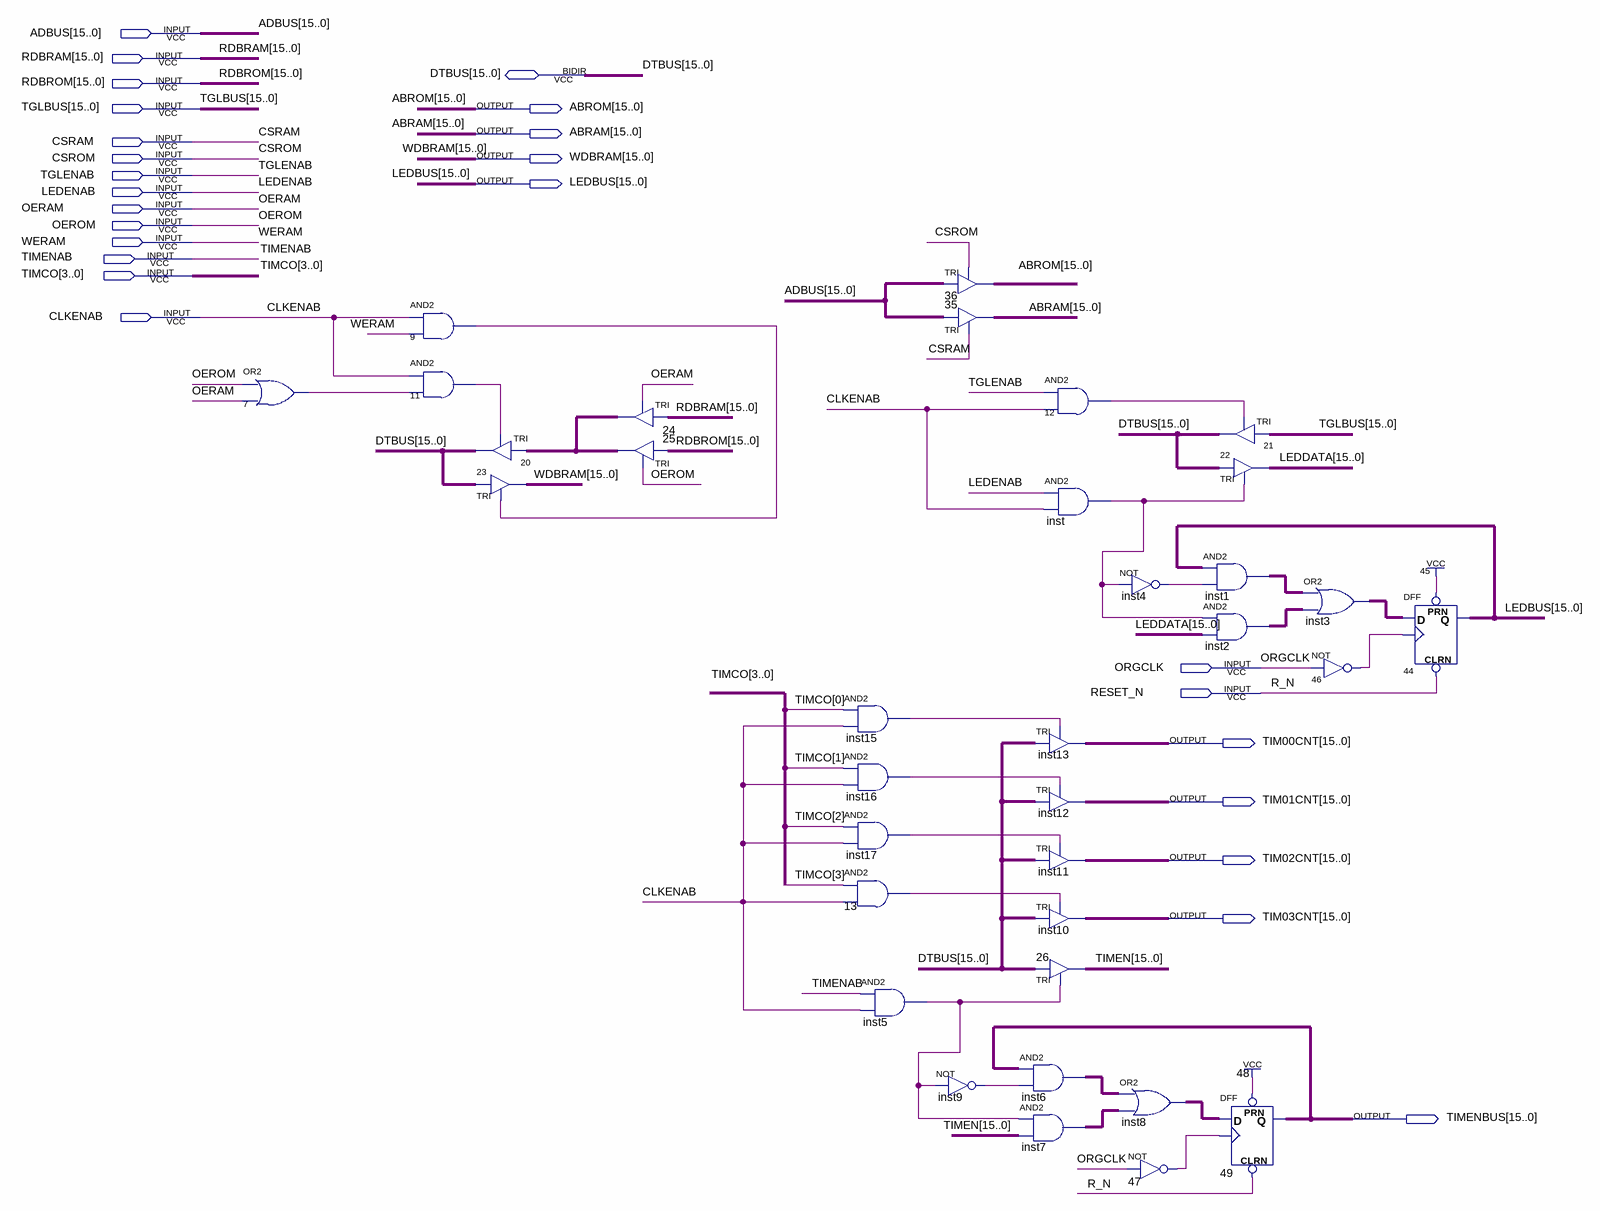
[diagram p0: schematic sheet]
// Quartus schematic sep5_busctrl_timer.bdf as structural Verilog: 35 symbols, 26 pins
module sep5_busctrl_timer (
  input  [15:0] ADBUS,
  input  [15:0] RDBRAM,
  input  [15:0] RDBROM,
  input  [15:0] TGLBUS,
  input  CSRAM,
  input  CSROM,
  input  TGLENAB,
  input  LEDENAB,
  input  OERAM,
  input  OEROM,
  input  WERAM,
  input  TIMENAB,
  input  [3:0] TIMCO,
  input  CLKENAB,
  input  ORGCLK,
  input  RESET_N,
  inout  [15:0] DTBUS,
  output [15:0] ABROM,
  output [15:0] ABRAM,
  output [15:0] WDBRAM,
  output [15:0] LEDBUS,
  output [15:0] TIM00CNT,
  output [15:0] TIM01CNT,
  output [15:0] TIM02CNT,
  output [15:0] TIM03CNT,
  output [15:0] TIMENBUS
);

  wire inst4_out, inst5_out, inst9_out, inst15_out, inst16_out, inst17_out, inst_out, n7_out, n9_out,
       n11_out, n12_out, n13_out, n46_out, n47_out;
  wire [15:0] inst1_out, inst2_out, inst3_out, inst6_out, inst7_out, inst8_out, LEDDATA, n24_out, TIMEN;

  or u_7 (n7_out, OEROM, OERAM);
  and u_9 (n9_out, CLKENAB, WERAM);
  and u_11 (n11_out, CLKENAB, n7_out);
  TRI u_20[15:0] (.IN(n24_out), .OE(n11_out), .OUT(DTBUS));
  TRI u_23[15:0] (.IN(DTBUS), .OE(n9_out), .OUT(WDBRAM));
  TRI u_24[15:0] (.IN(RDBRAM), .OE(OERAM), .OUT(n24_out));
  TRI u_25[15:0] (.IN(RDBROM), .OE(OEROM), .OUT(n24_out));
  and inst15 (inst15_out, TIMCO[0], CLKENAB);
  and inst16 (inst16_out, TIMCO[1], CLKENAB);
  and inst17 (inst17_out, TIMCO[2], CLKENAB);
  and u_13 (n13_out, TIMCO[3], CLKENAB);
  and inst5 (inst5_out, TIMENAB, CLKENAB);
  TRI u_36[15:0] (.IN(ADBUS), .OE(CSROM), .OUT(ABROM));
  TRI u_35[15:0] (.IN(ADBUS), .OE(CSRAM), .OUT(ABRAM));
  not inst9 (inst9_out, inst5_out);
  and u_12 (n12_out, TGLENAB, CLKENAB);
  and inst (inst_out, LEDENAB, CLKENAB);
  TRI inst13[15:0] (.IN(DTBUS), .OE(inst15_out), .OUT(TIM00CNT));
  TRI inst12[15:0] (.IN(DTBUS), .OE(inst16_out), .OUT(TIM01CNT));
  TRI inst11[15:0] (.IN(DTBUS), .OE(inst17_out), .OUT(TIM02CNT));
  TRI inst10[15:0] (.IN(DTBUS), .OE(n13_out), .OUT(TIM03CNT));
  TRI u_26[15:0] (.IN(DTBUS), .OE(inst5_out), .OUT(TIMEN));
  assign inst6_out = TIMENBUS & {16{inst9_out}};  // AND2 inst6, 16 bits wide
  assign inst7_out = {16{inst5_out}} & TIMEN;  // AND2 inst7, 16 bits wide
  not inst4 (inst4_out, inst_out);
  assign inst8_out = inst6_out | inst7_out;  // OR2 inst8, 16 bits wide
  not u_47 (n47_out, ORGCLK);
  TRI u_21[15:0] (.IN(TGLBUS), .OE(n12_out), .OUT(DTBUS));
  TRI u_22[15:0] (.IN(DTBUS), .OE(inst_out), .OUT(LEDDATA));
  assign inst1_out = LEDBUS & {16{inst4_out}};  // AND2 inst1, 16 bits wide
  assign inst2_out = {16{inst_out}} & LEDDATA;  // AND2 inst2, 16 bits wide
  DFF u_49[15:0] (.CLRN(RESET_N), .CLK(n47_out), .D(inst8_out), .PRN(1'b1), .Q(TIMENBUS));
  assign inst3_out = inst1_out | inst2_out;  // OR2 inst3, 16 bits wide
  not u_46 (n46_out, ORGCLK);
  DFF u_44[15:0] (.CLRN(RESET_N), .CLK(n46_out), .D(inst3_out), .PRN(1'b1), .Q(LEDBUS));

  // Other names for the same wires on the sheet: R_N = RESET_N
endmodule
